# EAGLE design 238_power measure102 (EAGLE 9.6.2)
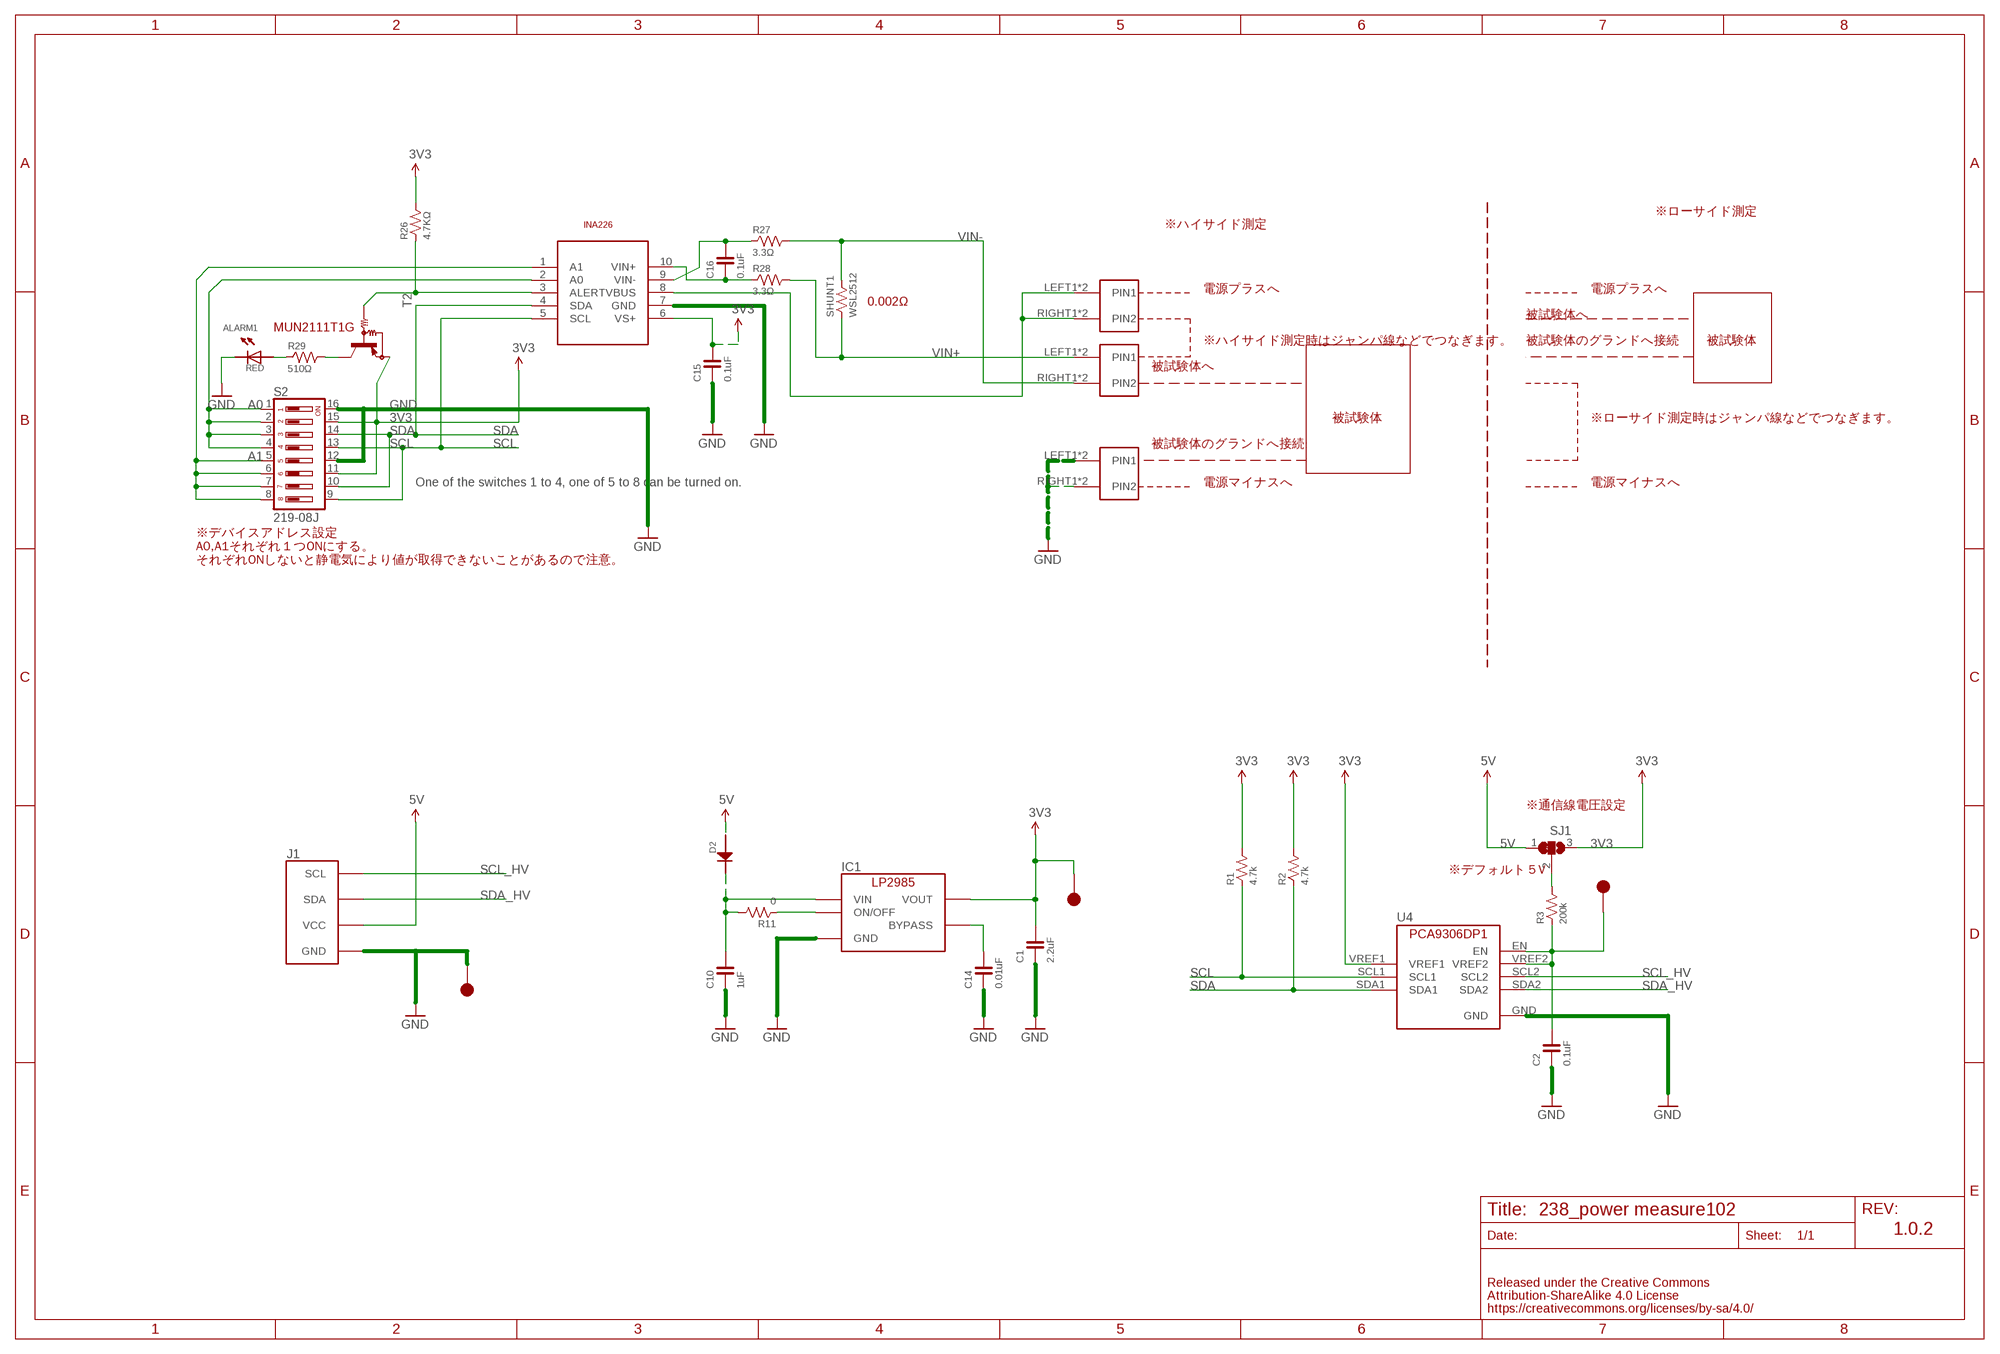
[diagram p0: schematic, sheet 1]

## Parts
ALARM1  RED  LED-0603  [0603]
C1  2.2uF  CAPACITOR-0603  [0603]
C2  0.1uF  CAPACITOR-0603  [0603]
C10  1uF  CAPACITOR-0603  [0603]
C14  0.01uF  CAPACITOR-0603  [0603]
C15  0.1uF  CAPACITOR-0603  [0603]
C16  0.1uF  CAPACITOR-0603  [0603]
D2  1N4148  [1N4148W]
IC1  LP2985-33  LP2985-33DBV  [SOT-23-5]
J1  FABO_BRICK_I2C-S04B-PASK-2  [FABO_BRICK_I2C_S04B-PASK-2]
R1  4.7k  RESISTOR-0603  [0603]
R2  4.7k  RESISTOR-0603  [0603]
R3  200k  RESISTOR-0603  [0603]
R11  0  RESISTOR-0603  [0603]
R26  4.7KΩ  RESISTOR-0603  [0603]
R27  3.3Ω  RESISTOR-0603  [0603]
R28  3.3Ω  RESISTOR-0603  [0603]
R29  510Ω  RESISTOR-0603  [0603]
S2  219-08J  [CTS-219-08J]
SHUNT1  WSL2512  [2512INCH]
SJ1  SJ2W  [SJ_2]
T2  MUN2111T1-PNP_DRIVER-SC59-BEC  [SC59-BEC]
TP1  TP-15  [TP-15]
TP2  TP-15  [TP-15]
TP5  TP-15  [TP-15]
U3  TI-INA226  [TI-INA226]
U4  PCA9306DP1  [TSSOP8]
U$23  ML-1400-S1  [ML-1400-S1]
U$24  ML-1400-S1  [ML-1400-S1]
U$25  ML-1400-S1  [ML-1400-S1]

## Nets
3V3: C1.2 C15.2 IC1.5(VOUT) R1.2 R2.2 R26.2 S2.11 S2.15 SJ1.3 T2.E TP5.1 U3.6(VS+) U4.VREF1
5V: D2.ANODE J1.VCC SJ1.1
A0: S2.1 S2.2 S2.3 S2.4 U3.2(A0)
A1: S2.5 S2.6 S2.7 S2.8 U3.1(A1)
GND: ALARM1.CATHODE C1.1 C2.1 C10.1 C14.1 C15.1 IC1.2(GND) J1.GND S2.12 S2.16 TP1.1 U3.7(GND) U4.GND U$25.LEFT1(PIN1) U$25.LEFT2(PIN1) U$25.RIGHT1(PIN2) U$25.RIGHT2(PIN2)
N$8: C2.2 R3.1 TP2.1 U4.EN U4.VREF2
N$9: R3.2 SJ1.2
N$11: IC1.3(ON/OFF) R11.1
N$25: C16.2 R27.1 U3.9(VIN-)
N$26: C16.1 R28.1 U3.10(VIN+)
N$27: R26.1 T2.B U3.3(ALERT)
N$28: ALARM1.ANODE R29.1
N$29: R29.2 T2.C
N$30: C14.2 IC1.4(BYPASS)
N$32: U3.8(VBUS) U$23.LEFT1(PIN1) U$23.LEFT2(PIN1) U$23.RIGHT1(PIN2) U$23.RIGHT2(PIN2)
N$36: C10.2 D2.CATHODE IC1.1(VIN) R11.2
SCL: R1.1 S2.9 S2.13 U3.5(SCL) U4.SCL1
SCL_HV: J1.SCL U4.SCL2
SDA: R2.1 S2.10 S2.14 U3.4(SDA) U4.SDA1
SDA_HV: J1.SDA U4.SDA2
VIN+: R28.2 SHUNT1.P$1 U$24.LEFT1(PIN1) U$24.LEFT2(PIN1)
VIN-: R27.2 SHUNT1.P$2 U$24.RIGHT1(PIN2) U$24.RIGHT2(PIN2)

## Notes on the sheet
- ※ローサイド測定
- ※ハイサイド測定
- 電源プラスへ | 電源プラスへ
- 0.002Ω
- 被試験体へ
- MUN2111T1G
- ※ハイサイド測定時はジャンパ線などでつなぎます。 | 被試験体のグランドへ接続 | 被試験体
- 被試験体へ
- 被試験体 | ※ローサイド測定時はジャンパ線などでつなぎます。
- 被試験体のグランドへ接続
- One of the switches 1 to 4, one of 5 to 8 can be turned on. | 電源マイナスへ | 電源マイナスへ
- ※デバイスアドレス設定
  A0,A1それぞれ１つONにする。
  それぞれONしないと静電気により値が取得できないことがあるので注意。
- ※通信線電圧設定
- ※デフォルト５V
- 1.0.2

## Library data of the parts
ALARM1 = FaBo-LED:LED
C1 C2 C10 C14-C16 = FaBo-Capacitor:CAPACITOR: CAPACITOR
D2 = FaBo-Diode:1N4148
IC1 = FaBo-Supply:LP2985: LP2985
J1 = FaBo-Template:FABO_BRICK_I2C: FaBo Brick I2C
R1-R3 R11 R26-R29 = FaBo-Resistors:RESISTOR: RESISTOR
S2 = switch-dil:219-08*: Surface Mount DIP Switch Series 219 SMT CTS Electronic Components Sourc: www.ctscorp.com; OC_FARNELL: unknown; OC_NEWARK: unknown
SHUNT1 = FaBo-Resistors:WSL2512
SJ1 = jumper:SJ2W: SMD solder JUMPER
T2 = transistor:*-PNP_DRIVER-: PNP Bias Resistor Transistor
TP1 TP2 TP5 = FaBo-Supply:TP
U3 = FaBo-Sensor:TI-INA226
U4 = FaBo-LevelTranslator:PCA9306DP1
U$23-U$25 = FaBo-Terminal:ML-1400-S1

## Board
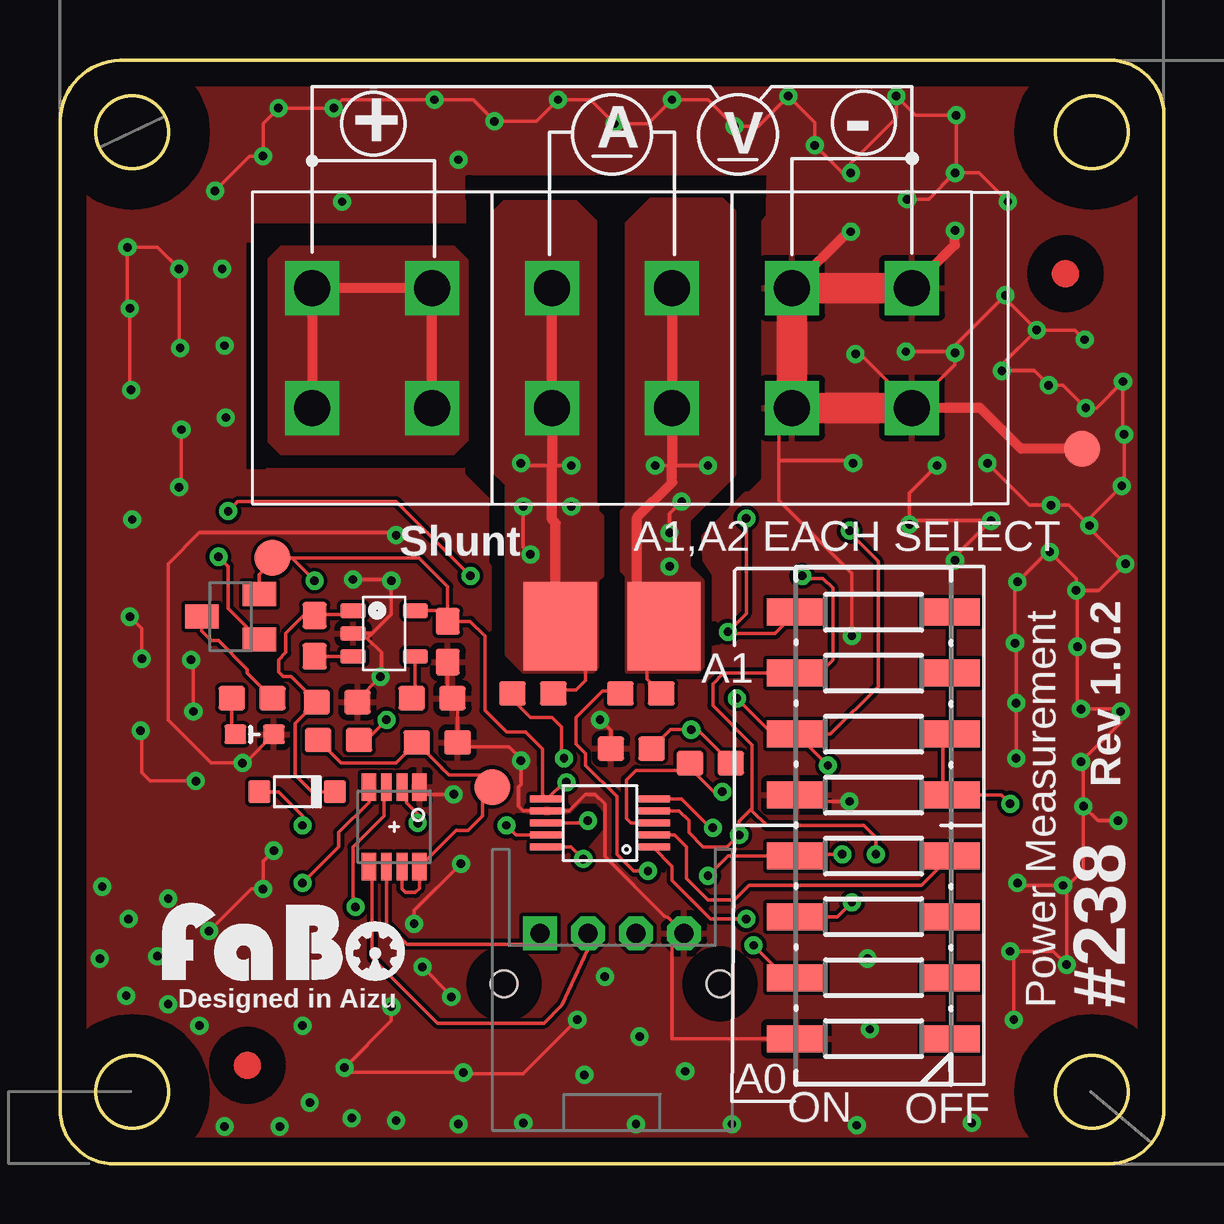
[diagram p1: board, top side]
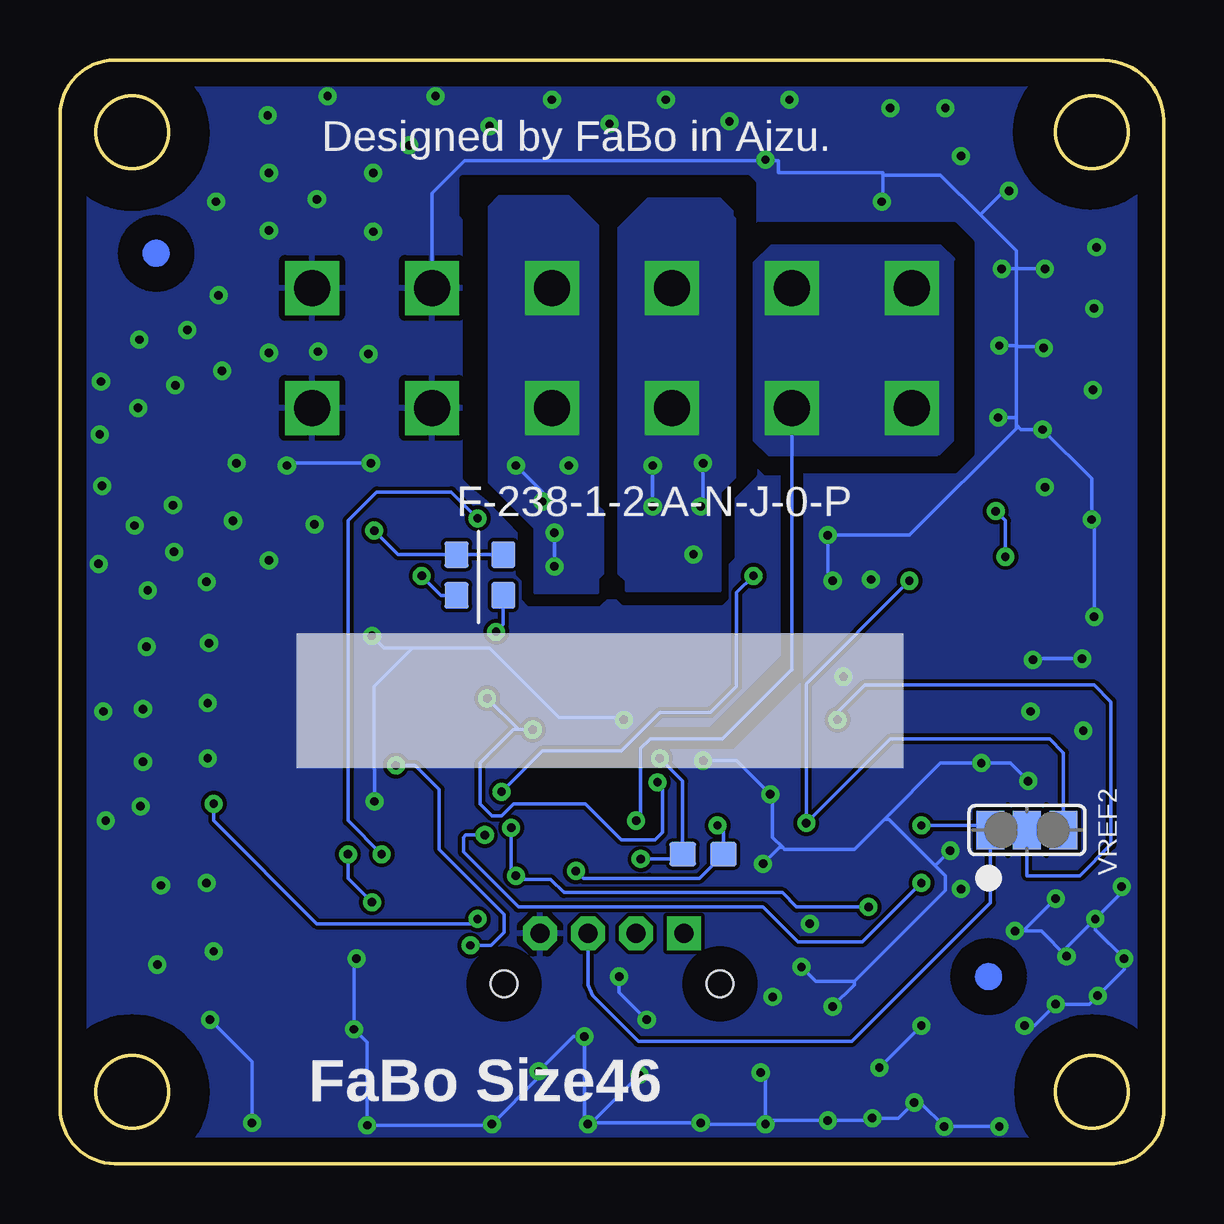
[diagram p2: board, bottom side, seen from below]

Size 46.02 x 46.02 mm. Coordinates in mm from the lower left corner, seen from the top.
Outline: 0.01,2.51 0.01,43.51 arc-87 2.51,46.01 43.51,46.01 arc-100 46.01,43.51 46.01,2.51 arc-99 43.51,0.01 2.51,0.01 arc-102 0.01,2.51
Outline: circle at 3.01,3.01 radius 1.5
Outline: circle at 43.01,3.01 radius 1.5
Outline: circle at 43.01,43.01 radius 1.5
Outline: circle at 3.01,43.01 radius 1.5
Copper layers (1*16): Top 0.035mm / dielectric 1.5mm / Bottom 0.035mm
Design rules "default *": minimum track width 6mil, minimum drill 0.35mm, track to track 6mil, track to pad 6mil, pad to pad 6mil, via to via 6mil, smd to smd 6mil, copper to edge 40mil, drill to drill 6mil, minimum pad ring 10mil, minimum via ring 8mil, stop-mask expansion 4mil, vias tented up to drill 0.4mm, thermal gap 10mil
tRestrict: area 8.1,38.4 to 17.9,39.2; area 7.8,29 to 8.6,38.4; area 17.1,29.1 to 17.8,38.4; area 8.6,29.1 to 17.1,29.5; area 22.4,27.5 to 23.5,41; area 22.7,20.5 to 23.3,27.5; area 17.1,40.3 to 22.4,41.2; area 17,39.2 to 17.9,40.3; area 23.5,40.4 to 29.4,41.2; area 28.2,28.2 to 28.7,40.4; area 0,0 to 6,6; area 0,40 to 6,46; 2 more areas; 112 lines
bRestrict: area 40,40 to 46,46; area 0.1,40 to 6.1,46; area 40,0 to 46,6; area 0,0 to 6,6; 67 lines

### Footprints (pad centres in the part's own frame; a part is rotated, then mirrored left to right if it is on the bottom)
0603 = smd 0.9 x 0.8: ANODE -0.8,0; CATHODE 0.8,0
0603' = smd 1.1 x 1: 1 -0.85,0; 2 0.85,0
1N4148W = smd 0.9 x 0.95: ANODE 0,0; CATHODE 3.15,0
SOT-23-5 = smd 0.6 x 1.05: 1 -0.95,-1.3; 2 0,-1.3; 3 0.95,-1.3; 4 0.95,1.3; 5 -0.95,1.3
FABO_BRICK_I2C_S04B-PASK-2 = drill 0.8 pad 1.422 octagon: GND -3,0; SDA 1,0; VCC -1,0 | drill 0.8 pad 1.422 square: SCL 3,0 | hole 1.1: 4.5,2.1; -4.5,2.1
CTS-219-08J = smd 1.13 x 2.44: 1 -8.89,-3.215; 2 -6.35,-3.215; 3 -3.81,-3.215; 4 -1.27,-3.215; 5 1.27,-3.215; 6 3.81,-3.215; 7 6.35,-3.215; 8 8.89,-3.215; 9 8.89,3.215; 10 6.35,3.215; 11 3.81,3.215; 12 1.27,3.215; 13 -1.27,3.215; 14 -3.81,3.215; 15 -6.35,3.215; 16 -8.89,3.215
2512INCH = smd 3.05 x 3.68: P$1 -2.16,0; P$2 2.16,0
SJ_2 = smd 1.168 x 1.6: 1 -1.524,0; 2 0,0; 3 1.524,0
SC59-BEC = smd 1 x 1.4: B -0.95,-1.2; C 0,1.2; E 0.95,-1.2
TP-15 = smd 1.5 x 1.5: 1 0,0
TI-INA226 = smd 1.45 x 0.3: 1 -2.2,1; 2 -2.2,0.5; 3 -2.2,0; 4 -2.2,-0.5; 5 -2.2,-1; 6 2.2,-1; 7 2.2,-0.5; 8 2.2,0; 9 2.2,0.5; 10 2.2,1
TSSOP8 = smd 0.6 x 1.15: EN -1.05,1.663; GND -1.05,-1.663; SDA1 1.05,-1.663; SDA2 1.05,1.663 | smd 0.45 x 1.15: SCL1 0.325,-1.663; SCL2 0.325,1.663; VREF1 -0.325,-1.663; VREF2 -0.325,1.663
ML-1400-S1 = drill 1.5 square: LEFT1 -2.5,2.5; LEFT2 -2.5,-2.5; RIGHT1 2.5,2.5; RIGHT2 2.5,-2.5

### Placement (x,y rotation side)
ALARM1  8.11,17.91 0 top
C1  2.2uF  [0603']  16.16,21.77 90 top
C2  0.1uF  [0603']  15.72,17.57 180 top
C10  1uF  [0603']  11.55,19.25 180 top
C14  0.01uF  [0603']  15.51,19.41 180 top
C15  0.1uF  [0603']  23.81,17.31 0 top
C16  0.1uF  [0603']  19.21,12.91 0 bottom
D2  8.31,15.51 0 top
IC1  13.51,22.11 270 top
J1  23.01,9.61 180 top
R1  4.7k  [0603']  27.54,24.55 90 bottom
R2  4.7k  [0603']  29.49,24.55 90 bottom
R3  200k  [0603']  11.61,17.67 0 top
R11  0  [0603']  10.61,22.01 90 top
R26  4.7KΩ  [0603']  27.11,16.71 0 top
R27  3.3Ω  [0603']  24.21,19.61 0 top
R28  3.3Ω  [0603']  19.71,19.61 0 top
R29  510Ω  [0603']  8.01,19.41 0 top
S2  33.91,14.11 90 top
SHUNT1  23.01,22.41 0 top
SJ1  5.71,13.92 0 bottom
T2  7.11,22.81 90 top
TP1  42.61,29.81 0 top
TP2  18.01,15.71 0 top
TP5  8.86,25.26 0 top
U3  22.51,14.21 180 top
U4  13.93,14.05 180 top
U$1  [MARK_POINT_3MM]  7.81,4.11 0 top
U$3  [MARK_POINT_3MM]  7.31,7.81 0 bottom
U$4  [MARK_POINT_3MM]  41.91,37.11 0 top
U$5  [MARK_POINT_3MM]  42.01,37.96 0 bottom
U$14  [LOGO_FABO_MS]  9.33,7.27 0 top
U$23  13.01,34.01 0 top
U$24  23.01,34.01 0 top
U$25  33.01,34.01 0 top

### Tracks (layer width: path | path; a pad name or v marks a point on that pad's centre or on a via)
3V3  (via drill 0.35)
  Top 0.152: IC1.5 15.72,23.06 C1.2 | C1.2 16.16,24.06 14.96,25.26 9.71,25.26 | 9.71,25.26 9.01,25.26 | 9.01,25.26 TP5.1 | T2.E 8.31,24.56 9.01,25.26 | U4.VREF1 14.45,15.52 14.45,15.04 14.91,14.59 v14.91,14.21 | v10.61,24.31 9.71,25.21 9.71,25.26 | C1.2 17.1,22.62 17.71,22.01 17.71,18.91 18.61,18.01 19.41,18.01 20.12,17.3 20.12,16.66 20.11,16.65 20.11,15.41 U3.6 21.01,15.91 v21.11,15.91 | C15.2 25.45,18.1 v26.31,18.1 26.57,18.1 R26.2 | v32.01,16.61 S2.11 | S2.11 29.7,17.92 v28.21,19.41 | S2.11 32.12,17.92 34.11,19.91 34.11,25.11 32.92,26.3 v32.92,26.4 | S2.15 30.26,7.76 v28.91,9.11
  Bottom 0.152: v28.21,19.41 26.91,18.11 | 26.91,18.11 26.9,18.1 v26.31,18.1 | v10.61,24.31 14.91,20.01 v14.91,14.21 11.41,17.71 4.76,17.71 4.19,17.14 SJ1.3 | v28.91,9.11 28.05,9.11 27.5,9.66 27.5,10.4 30.21,13.11 30.21,15.61 31.21,16.61 v32.01,16.61 | v32.92,26.4 31.92,25.4 R2.2 R1.2 | 26.91,18.11 27.11,18.11 28.51,16.71 28.51,15.01 28.02,14.52 27.6,14.52 27.11,15.01 24.11,15.01 22.61,13.51 21.21,13.51 20.91,13.81 20.91,15.71 v21.11,15.91
5V  (via drill 0.35)
  Top 0.152: D2.ANODE 9.11,15.51 10.11,14.51 v10.11,14.11
  Bottom 0.152: J1.VCC 24.01,7.47 23.83,7.03 21.91,5.11 13.01,5.11 7.24,10.89 SJ1.1 7.43,14.11 v10.11,14.11
A0
  Top 0.152: S2.1 S2.2 S2.3 S2.4 35.9,11.61 28.71,11.61 28.11,11.01 27.01,11.01 26.11,11.91 26.11,13.21 25.61,13.71 U3.2
A1  (via drill 0.35)
  Top 0.152: S2.8 S2.7 S2.6 36.81,17.61 36.81,15.38 S2.5 39.24,15.38 v39.61,15.01 | U3.1 25.51,12.41 25.51,11.81 27.11,10.21 v28.61,10.21
  Bottom 0.152: v28.61,10.21 28.81,10.01 35.31,10.01 39.61,14.31 v39.61,15.01
GND  (via drill 0.35)
  Top 0.152: 30.49,31.55 U$25.LEFT2 29.96,30.96 29.96,29.31 | v22.51,18.51 22.96,18.06 C15.1 | 30.73,5.72 S2.16 | 30.74,5.72 S2.16 | C1.1 16.16,19.61 C14.1 16.57,19.2 16.57,17.71 | C2.1 16.57,17.71 | U4.GND 15.28,15.41 v16.41,15.41 | 16.57,17.71 16.89,17.39 18.72,17.39 19.21,16.9 v19.21,16.81 19.21,15.81 19.11,15.71 19.11,14.91 19.31,14.71 U3.7 21.21,14.71 21.91,15.41 22.31,15.41 22.71,15.01 22.71,12.81 25.18,10.34 25.37,10.25 J1.GND 25.51,9.47 25.51,5.22 S2.16 | ALARM1.CATHODE 7.71,16.71 v7.61,16.71 6.31,16.71 4.51,18.51 4.51,25.01 5.81,26.31 13.91,26.31 v14.01,26.21 | 13.01,22.11 IC1.2 | 13.01,22.11 13.81,22.91 v13.81,24.31 13.76,24.36 v12.21,24.36 | 13.01,22.11 12.81,21.91 13.41,21.31 13.41,20.36 v13.36,20.31 12.4,19.35 C10.1 | v32.91,15.11 30.97,15.11 S2.12 | v33.01,22.01 33.01,24.61 29.96,27.66 29.96,29.31 | 29.96,29.31 32.96,29.31 v33.06,29.21 | v33.16,33.76 33.36,33.76 35.51,31.61 U$25.RIGHT2 37.31,33.31 37.31,33.76 | 37.31,33.76 v37.31,33.81 37.31,34.11 v39.41,36.21 39.41,36.06 v40.71,34.76 | v15.11,8.21 16.31,7.01 v16.31,6.96 | v21.56,6.01 19.31,3.76 16.86,3.76 v16.81,3.81 12.06,3.81 v11.86,4.01 13.81,5.96 v13.81,6.56 | v3.36,18.06 3.41,18.01 3.41,16.31 3.76,15.96 v5.66,15.96 | v14.76,10.01 14.76,10.56 v16.71,12.51 | v2.96,32.26 2.91,32.31 v2.91,35.66 2.81,35.76 v2.81,38.21 4.06,38.21 v4.96,37.31 4.96,34.06 v5.01,34.01 | v5.06,30.61 5.06,28.31 v4.96,28.21 | v6.46,40.56 7.91,42.01 v8.46,42.01 8.46,43.36 v9.11,44.01 v11.41,44.01 11.76,44.36 v15.61,44.36 17.21,44.36 v18.11,43.46 19.86,43.46 v20.76,44.36 22.11,44.36 v23.11,43.36 24.51,43.36 v25.51,44.36 27.01,44.36 v28.11,43.26 29.11,43.26 v30.36,44.51 31.46,43.41 v31.46,42.46 32.61,41.31 v32.96,41.31 32.96,41.71 34.86,43.61 v34.86,44.51 35.66,43.71 v37.36,43.71 37.36,41.36 v37.31,41.31
  Top 0.152: v37.31,41.31 36.21,40.21 v35.31,40.21 | v37.31,41.31 38.31,41.31 v39.51,40.11 | v35.26,33.86 37.21,33.86 37.31,33.76 | v40.71,34.76 42.31,34.76 v42.71,34.36 | v40.71,34.76 39.26,33.31 v39.26,33.06 40.61,33.06 v41.21,32.46 41.81,32.46 v42.76,31.51 43.21,31.51 v44.31,32.61 44.31,30.46 v44.36,30.41 44.36,28.36 v44.26,28.26 42.91,26.91 v42.91,26.61 | v42.91,26.61 42.06,27.46 v41.31,27.46 40.41,27.46 v38.66,29.21 | v36.56,29.11 35.41,27.96 v35.41,26.66 35.56,26.81 v38.81,26.81 37.31,25.31 v37.31,25.16 | v39.76,6.01 39.76,8.71 v39.61,8.86 41.41,8.86 v41.96,8.31 41.96,11.46 41.91,11.51 | 41.91,11.51 v41.81,11.61 40.01,11.61 v39.91,11.71 | v42.66,14.91 42.66,12.26 41.91,11.51 | v42.66,14.91 43.26,14.31 v44.11,14.31 | v42.66,14.91 42.66,16.66 v42.56,16.76 44.21,18.41 v44.21,18.86 44.11,18.96 v42.56,18.96 42.41,19.11 v42.41,21.56 42.41,23.86 v42.36,23.91 | v39.86,16.91 v39.86,19.21 39.86,21.66 v39.81,21.71 39.81,24.16 v39.91,24.26 41.16,25.51 v41.26,25.51 42.36,24.41 v42.36,23.91 | v42.36,23.91 43.31,23.91 v44.41,25.01 42.91,26.51 v42.91,26.61 | v6.21,9.71 7.96,11.46 v8.46,11.46 8.46,12.61 v8.91,13.06 | v5.56,18.86 5.56,20.91 v5.46,21.01 | v3.41,21.06 3.41,22.31 v2.91,22.81
  Top 0.406: U$25.LEFT1 30.56,36.56 32.86,38.86 v32.96,38.86 | U$25.RIGHT1 37.31,38.31 v37.31,38.91 | TP1.1 40.06,29.81 38.36,31.51 U$25.RIGHT2
  Top 1.27: U$25.RIGHT1 30.61,36.51 30.56,36.56 | U$25.LEFT1 30.51,31.57 30.49,31.55 | U$25.LEFT2 35.41,31.51 35.51,31.61
  Bottom 0.152: v22.51,18.51 22.61,18.61 25.21,18.61 28.11,21.51 31.31,21.51 | v19.21,16.81 17.81,16.81 v16.41,15.41 16.31,15.31 16.31,13.61 15.89,13.19 | 15.89,13.19 15.81,13.11 12.91,13.11 11.66,14.36 | 11.66,14.36 9.31,16.71 v7.61,16.71 6.41,16.71 v5.66,15.96 | v13.81,24.31 14.01,24.51 v14.01,26.21 10.61,26.21 6.16,30.66 6.16,30.81 | 31.31,21.51 32.92,19.9 32.92,16.46 32.91,16.45 v32.91,15.11 | 31.31,21.51 32.51,21.51 v33.01,22.01 | 7.66,39.56 6.16,38.06 6.16,37.26 | 7.66,39.56 9.31,41.21 11.71,41.21 | 6.16,30.81 6.16,31.11 | 6.16,31.11 6.16,34.06 | 6.16,34.06 6.16,34.16 | 6.16,34.16 6.16,37.26 | v15.11,8.21 14.51,7.61 12.91,7.61 | 12.91,7.61 9.11,11.41 9.11,12.01 9.56,12.46 | 11.66,14.36 11.46,14.36 9.56,12.46 | 16.61,41.81 16.06,41.81 16.06,41.31 11.71,41.31 11.71,41.21 | 16.61,41.81 29.16,41.81 30.51,40.46 U$25.LEFT1 | v33.06,29.21 36.46,29.21 v36.56,29.11 | 6.16,30.81 5.96,30.61 v5.06,30.61 3.01,28.56 v3.01,26.86 2.91,26.76 v2.91,22.81 | v6.91,31.11 6.16,31.11 | v5.01,34.01 5.06,34.06 6.16,34.06 | v6.86,34.11 6.21,34.11 6.16,34.16 | v4.96,37.31 6.11,37.31 | 6.11,37.31 6.16,37.26 | v6.76,37.31 6.11,37.31 | v6.46,40.56 6.66,40.56 7.66,39.56 | v11.76,40.11 11.71,40.16 11.71,41.21 | v16.61,41.86 16.61,41.81 | v13.81,6.56 12.91,7.46 12.91,7.61 | 9.56,12.46 9.51,12.46 v8.91,13.06 | v16.71,12.51 16.04,13.19 15.89,13.19 | v33.66,8.56 33.76,8.46 v33.76,5.61 33.21,5.06 v33.21,1.61 28.06,1.61 v28.01,1.66 26.06,3.61 v26.06,3.86 24.61,5.31 v24.16,5.31 24.16,1.81 v24.01,1.66 23.91,1.66 23.86,1.71 | v38.01,1.71 38.01,4.26 v39.76,6.01 | v21.86,3.71 23.86,1.71 | v21.56,6.01 22.71,7.16 v22.71,7.81 | 23.86,1.71 v19.31,1.71 19.26,1.66 v16.61,1.66
  Bottom 0.152: v16.61,1.66 16.61,3.61 v16.81,3.81 | v16.61,1.66 16.46,1.81 v14.01,1.81 12.26,1.81 v12.16,1.91 11.06,1.91 10.44,2.54 | 10.44,2.54 v10.41,2.56 | v6.86,1.56 v9.16,1.56 10.14,2.54 10.44,2.54 | v10.11,5.76 v11.86,4.01 | v5.81,5.76 5.41,5.76 v4.51,6.66 3.11,6.66 v2.76,7.01 1.66,8.11 v1.66,8.56 2.86,9.76 v2.86,10.21 | v2.86,10.21 4.06,9.01 v4.06,8.66 5.11,9.71 v6.21,9.71 5.86,9.71 v4.51,11.06 | v2.86,10.21 1.76,11.31 v1.76,11.56 | v3.41,21.06 5.41,21.06 v5.46,21.01
  pour Top (isolate 0.04, rank 6): 0.01,46.01 46.01,46.01 46.01,0.01 0.01,0.01
  pour Bottom (isolate 0.04, rank 6): 0.01,46.01 46.01,46.01 46.01,0.01 0.01,0.01
N$8
  Top 0.152: U4.VREF2 14.26,11.47 14.41,11.31 14.81,11.31 14.98,11.48 U4.EN 16.5,13.91 17.01,13.91 17.61,14.51 17.61,15.31 TP2.1 17.51,16.21 16.21,16.21 15.91,16.51 15.91,16.53 C2.2 14.01,16.71 11.72,16.71 R3.1
N$9  (via drill 0.35)
  Top 0.152: v13.61,18.51 12.77,17.67 R3.2
  Bottom 0.152: SJ1.2 5.71,12.01 3.51,12.01 2.21,13.31 2.21,19.26 2.91,19.96 12.46,19.96 13.61,18.81 v13.61,18.51
N$11
  Top 0.152: R11.1 IC1.3
N$25  (via drill 0.35)
  Top 0.152: R27.1 23.26,19.71 22.61,19.71 21.52,18.62 21.52,17.51 21.91,17.11 21.91,16.61 23.21,15.31 23.21,12.91 23.91,12.21 v24.51,12.21 | U3.9 19.01,13.71 v18.61,14.11
  Bottom 0.152: v18.61,14.11 18.36,13.86 C16.2 19.36,11.91 21.45,11.91 21.46,11.9 24.2,11.9 v24.51,12.21
N$26  (via drill 0.35)
  Top 0.152: v21.01,16.91 20.91,17.01 20.91,18.21 20.51,18.61 19.61,18.61 18.86,19.36 R28.1 | U3.10 21.31,13.21 v21.81,12.71
  Bottom 0.152: v21.01,16.91 20.06,15.96 C16.1 20.26,12.71 v21.81,12.71
N$27  (via drill 0.35)
  Top 0.152: T2.B 7.01,23.16 7.01,24.91 v6.61,25.31 | v7.01,27.21 7.41,27.61 14.01,27.61 v17.11,24.51 | U3.3 23.81,14.21 23.61,14.41 23.61,16.01 24.01,16.41 26.36,16.41 | R26.1 26.16,16.61 26.36,16.41 | v27.61,15.51 27.26,15.51 26.36,16.41
  Bottom 0.152: v6.61,25.31 6.61,26.81 v7.01,27.21 | v27.61,15.51 25.91,17.21 22.61,17.21 21.01,18.81 18.91,18.81 17.81,19.91 17.81,23.81 v17.11,24.51
N$28
  Top 0.152: ALARM1.ANODE 7.16,18.06 R29.1
N$29
  Top 0.152: R29.2 7.81,20.46 7.81,20.61 6.61,21.81 6.31,21.81 5.91,22.21 T2.C
N$30
  Top 0.152: IC1.4 14.81,19.56 C14.2
N$32  (via drill 0.35)
  Top 0.152: U3.8 21.9,14.21 v22,14.31
  Top 0.406: U$23.RIGHT2 U$23.RIGHT1 U$23.LEFT1 U$23.LEFT2
  Bottom 0.152: U$23.RIGHT2 15.51,20.59 15.54,20.59 18.41,17.71 21.41,17.71 21.81,17.31 21.81,14.5 v22,14.31
  pour Top (no thermals): 9.21,29.61 8.71,30.11 8.71,37.71 9.21,38.21 16.41,38.21 17.01,37.61 17.01,30.21 16.41,29.61
  pour Bottom (no thermals): 8.76,37.71 9.31,38.26 16.36,38.26 17.06,37.56 17.06,30.16 16.46,29.56 9.46,29.56 9.41,29.61 9.36,29.61 8.81,30.16 8.81,37.66
N$36
  Top 0.152: 10.66,22.91 12.06,22.91 IC1.1 | R11.2 10.16,22.86 9.41,22.11 9.41,21.31 9.11,21.01 9.11,20.51 9.31,20.31 9.64,20.31 C10.2 9.81,18.36 9.81,16.21 10.51,15.51 D2.CATHODE
  Top 0.406: R11.2 10.66,22.91
SCL  (via drill 0.35)
  Top 0.152: U4.SCL1 13.51,15.62 13.51,14.51 12.21,13.21 12.21,10.82 v12.32,10.71 | U3.5 24.78,15.14 24.85,15.21 25.91,15.21 27.11,14.01 v27.21,14.01 | v32.61,12.91 30.77,12.91 S2.13 27.84,12.84 v27.01,12.01 | v28.61,26.91 28.61,22.95 v27.84,22.18 27.91,22.11 29.81,22.11 S2.9
  Bottom 0.152: v12.32,10.71 15.31,10.71 15.91,11.31 25.01,11.31 25.56,11.86 26.66,11.86 26.81,12.01 v27.01,12.01 27.21,12.21 v27.21,14.01 | v32.61,12.91 34.01,14.31 34.01,26.81 32.81,28.01 29.71,28.01 v28.61,26.91 | R1.1 27.54,22.48 v27.84,22.18
SCL_HV
  Top 0.152: J1.SCL 19.56,9.16 14.46,9.16 13.61,10.02 U4.SCL2
SDA  (via drill 0.35)
  Top 0.152: U4.SDA1 12.88,15.08 11.61,13.81 11.61,13.21 v10.11,11.71 | v30.94,24.51 31.04,24.41 31.81,24.41 32.21,24.01 32.21,21.01 31.66,20.46 S2.10 27.66,20.46 27.21,20.01 27.21,19.11 28.85,17.48 28.85,14.81 | 28.85,14.81 28.31,14.28 v28.31,13.71 27.81,13.21 26.81,13.21 26.21,13.81 26.21,14.31 25.81,14.71 U3.4 | 28.85,14.81 28.85,14.72 29.46,14.11 33.51,14.11 34.01,13.61 v34.01,12.91 | v33.01,10.91 32.4,10.3 S2.14
  Bottom 0.152: v10.11,11.71 12.56,9.26 15.26,9.26 16.71,10.71 26.91,10.71 29.2,13 29.2,13.61 29.1,13.71 v28.31,13.71 | v30.94,24.51 30.13,23.7 R2.1 | v34.01,12.91 34.01,11.91 v33.01,10.91
SDA_HV
  Top 0.152: U4.SDA2 13.01,12.26 13.01,8.59 15.73,5.87 20.17,5.87 20.92,6.62 22.01,8.97 J1.SDA
VIN+  (via drill 0.35)
  Top 0.152: v19.21,29.21 19.31,29.11 20.51,29.11 v21.31,29.11 | v19.31,27.41 19.31,25.71 v19.61,25.41 | 20.66,23.01 20.66,22.6 SHUNT1.P$1 21.01,22.41 21.91,21.51 21.91,20.16 21.51,19.76 20.71,19.76 R28.2
  Top 0.406: U$24.LEFT1 U$24.LEFT2 20.51,29.11 20.51,26.86 20.66,26.71 20.66,23.01
  Bottom 0.152: v19.21,29.21 19.21,27.51 v19.31,27.41 | v21.31,29.11 v21.31,27.41
  pour Top (no thermals): 19.31,20.51 18.61,21.21 18.61,28.31 18.01,28.91 18.01,39.61 18.51,40.11 21.51,40.11 22.41,39.21 22.41,27.21 22.61,27.01 22.61,24.51 22.41,24.31 22.41,20.71 22.21,20.51
  pour Bottom (no thermals): 18.01,39.51 18.01,39.71 18.51,40.21 21.51,40.21 22.71,39.01 22.71,24.61 22.41,24.31 22.41,23.91 18.51,23.91 18.51,28.01 17.91,28.61 17.91,39.41
VIN-  (via drill 0.35)
  Top 0.152: v24.81,29.11 25.51,29.11 v27.01,29.11 | v25.91,27.61 25.41,27.11 v25.41,26.31 | R27.2 24.46,20.21 24.46,22 25.17,22.71
  Top 0.406: 25.17,22.71 24.36,23.52 | U$24.RIGHT1 U$24.RIGHT2 25.51,29.11 25.51,28.41 24.06,26.96 24.06,23.52 SHUNT1.P$2
  Bottom 0.152: v27.01,29.11 25.91,28.01 v25.91,27.61 | v25.41,26.31 v25.41,24.91
  pour Top (no thermals): 23.61,20.51 23.61,24.51 23.41,24.71 23.41,27.21 23.61,27.41 23.61,39.21 24.61,40.21 27.61,40.21 28.11,39.71 28.11,28.71 26.21,26.81 26.21,24.91 26.81,24.31 26.81,20.71 26.61,20.51
  pour Bottom (no thermals): 23.61,39.11 24.81,40.31 27.71,40.31 28.11,39.91 28.11,28.41 26.21,26.51 26.21,23.81 23.61,23.81 23.61,24.41 23.41,24.61 23.41,27.21 23.61,27.41

### Text on the board
tPlace: + | A | V | - | Shunt | A1,A2 EACH SELECT | A1 | Rev 1.0.2 | Designed in Aizu | Power Measurement | #238 | A0 | ON | OFF
bPlace: Designed by FaBo in Aizu. | F-238-1-2-A-N-J-0-P | VREF2 | FaBo Size46
tDocu: FaBo Brick New Size Type 46 / 寸法図 | R-2.5 | #238 FaBo PowerMeasurement Rev1.0.2